# Altium project pcb_82.PrjPcb
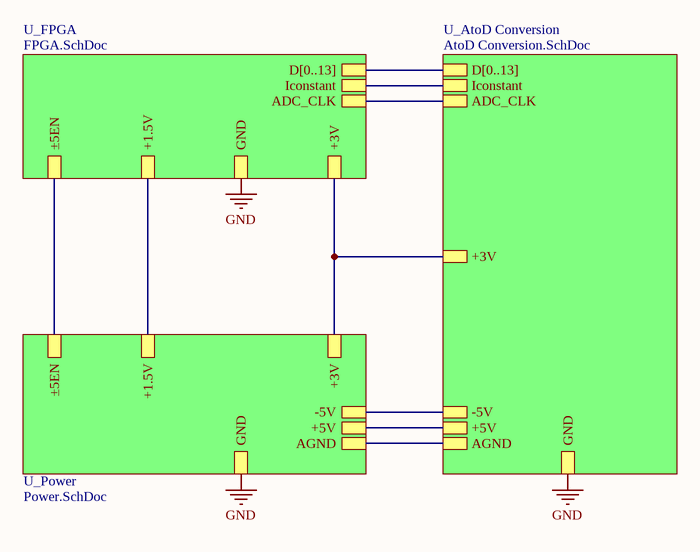
[diagram p0: TOP.SchDoc]
4 sheets, 164 parts. Net scope: hierarchical (ports join the sheet entries above them; power ports are global).
Board file: pcb_82.PcbDoc
Sheets:
  TOP.SchDoc
    U_AtoD Conversion = AtoD Conversion.SchDoc
    U_FPGA = FPGA.SchDoc
    U_Power = Power.SchDoc

## Sheet TOP.SchDoc
size A4; SheetNumber: 1; SheetTotal: 4

### Sub-sheets
U_AtoD Conversion = AtoD Conversion.SchDoc: -5V, +5V, +3V, ADC_CLK, GND, AGND, D[0..13], Iconstant
U_FPGA = FPGA.SchDoc: GND, ±5EN, +1.5V, +3V, Iconstant, D[0..13], ADC_CLK
U_Power = Power.SchDoc: GND, ±5EN, +5V, -5V, +1.5V, +3V, AGND

### Nets
+1.5V: sheet U_FPGA/+1.5V, sheet U_Power/+1.5V
+3V: sheet U_AtoD Conversion/+3V, sheet U_FPGA/+3V, sheet U_Power/+3V
+5V: sheet U_AtoD Conversion/+5V, sheet U_Power/+5V
-5V: sheet U_AtoD Conversion/-5V, sheet U_Power/-5V
AGND: sheet U_AtoD Conversion/AGND, sheet U_Power/AGND
GND: sheet U_AtoD Conversion/GND, sheet U_FPGA/GND, sheet U_Power/GND
NetB4_1: sheet U_AtoD Conversion/ADC_CLK, sheet U_FPGA/ADC_CLK
NetQ4_1: sheet U_AtoD Conversion/Iconstant, sheet U_FPGA/Iconstant
NetU4_4: sheet U_FPGA/±5EN, sheet U_Power/±5EN

### Buses and harness runs
bus sheet U_AtoD Conversion/D[0..13] = sheet U_FPGA/D[0..13]

### Notes on the sheet
- Page
- of

## Sheet AtoD Conversion.SchDoc
size A4; SheetNumber: 4; SheetTotal: 4
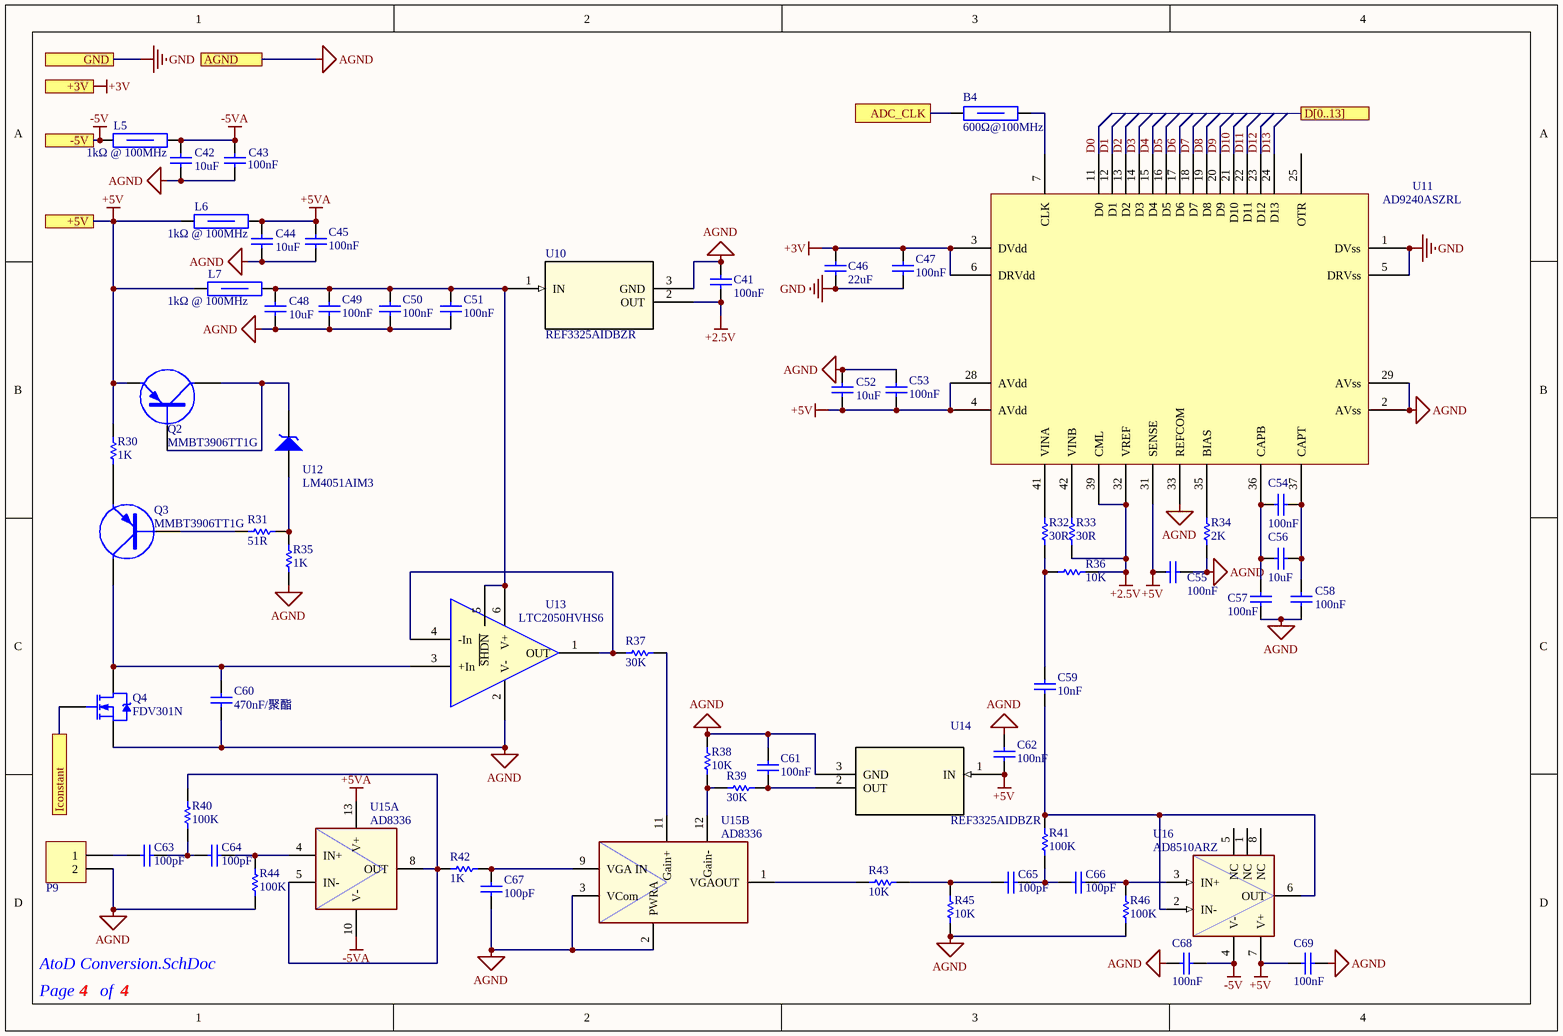
[diagram p1: AtoD Conversion.SchDoc]

### Parts
B4  600Ω@100MHz  [R0805_L]
C41  100nF  [R0603_C]
C42  10uF  [R0805_C]
C43  100nF  [R0603_C]
C44  10uF  [R0805_C]
C45  100nF  [R0603_C]
C46  22uF  [R0805_C]
C47  100nF  [R0603_C]
C48  10uF  [R0805_C]
C49  100nF  [R0603_C]
C50  100nF  [R0603_C]
C51  100nF  [R0603_C]
C52  10uF  [R0805_C]
C53  100nF  [R0603_C]
C54  100nF  [R0603_C]
C55  100nF  [R0603_C]
C56  10uF  [R0805_C]
C57  100nF  [R0603_C]
C58  100nF  [R0603_C]
C59  10nF  [R0603_C]
C60  470nF/聚酯  [P=10MM -L]
C61  100nF  [R0603_C]
C62  100nF  [R0603_C]
C63  100pF  [R0603_C]
C64  100pF  [R0603_C]
C65  100pF  [R0603_C]
C66  100pF  [R0603_C]
C67  100pF  [R0603_C]
C68  100nF  [R0603_C]
C69  100nF  [R0603_C]
L5  1kΩ @ 100MHz  [R1206_L]
L6  1kΩ @ 100MHz  [R1206_L]
L7  1kΩ @ 100MHz  [R1206_L]
P9  Header 2  [CP1X2]  (value not drawn)
Q2  MMBT3906TT1G  [SOT-23(SOT-23-3)]
Q3  MMBT3906TT1G  [SOT-23(SOT-23-3)]
Q4  FDV301N  [SOT-23]
R30  1K  [R0603_R]
R31  51R  [R0603_R]
R32  30R  [R0603_R]
R33  30R  [R0603_R]
R34  2K  [R0603_R]
R35  1K  [R0603_R]
R36  10K  [R0603_R]
R37  30K  [R0603_R]
R38  10K  [R0603_R]
R39  30K  [R0603_R]
R40  100K  [R0603_R]
R41  100K  [R0603_R]
R42  1K  [R0603_R]
R43  10K  [R0603_R]
R44  100K  [R0603_R]
R45  10K  [R0603_R]
R46  100K  [R0603_R]
U10  REF3325AIDBZR  [SOT-23(SOT-23-3)]
U11  AD9240ASZRL  [MQFP44]
U12  LM4051AIM3  [SOT-23(SOT-23-3)]
U13  LTC2050HVHS6  [DBV0006A_N]
U14  REF3325AIDBZR  [SOT-23(SOT-23-3)]
U15  AD8336  [LFCSP16]  (parts A,B of 2)
U16  AD8510ARZ  [SOP-8_150mil]

### Ports
+3V, +5V, -5V, ADC_CLK, AGND, D[0..13], GND, Iconstant

### Nets
+2.5V: C41.2 R33.1 R36.1 U10.2(OUT) U11.32(VREF) U11.39(CML)
+3V: C46.2 C47.2 U11.3(DVdd) U11.6(DRVdd) ; port +3V
+5V: C52.1 C53.1 C55.2 C62.1 C69.2 L6.1 L7.1 Q2.2(E) R30.2 U11.4(AVdd) U11.28(AVdd) U11.31(SENSE) U14.1(IN) U16.7(V+) ; port +5V
+5VA: C44.2 C45.2 L6.2 U15.13(V+)
-5V: C68.1 L5.1 U16.4(V-) ; port -5V
-5VA: C42.2 C43.2 L5.2 U15.10(V-)
AGND: C41.1 C42.1 C43.1 C44.1 C45.1 C48.1 C49.1 C50.1 C51.1 C52.2 C53.2 C55.1 C57.2 C58.2 C60.1 C61.2 C62.2 C67.1 C68.2 C69.1 P9.2 Q4.2(S) R34.1 R35.1 R38.2 R44.2 R45.1 R46.2 U10.3(GND) U11.2(AVss) U11.29(AVss) U11.33(REFCOM) U13.2(V-) U14.3(GND) U15.2(PWRA) U15.3(VCom) ; port AGND
GND: C46.1 C47.1 U11.1(DVss) U11.5(DRVss) ; port GND
D0: U11.11(D0)
D1: U11.12(D1)
D2: U11.13(D2)
D3: U11.14(D3)
D4: U11.15(D4)
D5: U11.16(D5)
D6: U11.17(D6)
D7: U11.18(D7)
D8: U11.19(D8)
D9: U11.20(D9)
D10: U11.21(D10)
D11: U11.22(D11)
D12: U11.23(D12)
D13: U11.24(D13)
NetB4_1: B4.1 ; port ADC_CLK
NetB4_2: B4.2 U11.7(CLK)
NetC48_2: C48.2 C49.2 C50.2 C51.2 L7.2 U10.1(IN) U13.5(~{SHDN}) U13.6(V+)
NetC54_1: C54.1 C56.1 C58.1 U11.37(CAPT)
NetC54_2: C54.2 C56.2 C57.1 U11.36(CAPB)
NetC59_1: C59.1 R41.1 U16.2(IN-) U16.6(OUT)
NetC59_2: C59.2 R32.1 R36.2
NetC60_2: C60.2 Q3.3(C) Q4.3(D) U13.3(+In)
NetC61_1: C61.1 R39.1 U14.2(OUT)
NetC63_1: C63.1 P9.1
NetC63_2: C63.2 C64.1 R40.2
NetC64_2: C64.2 R44.1 U15.4(IN+)
NetC65_1: C65.1 R43.1 R45.2
NetC65_2: C65.2 C66.1 R41.2
NetC66_2: C66.2 R46.1 U16.3(IN+)
NetC67_2: C67.2 R42.1 U15.9(VGA_IN)
NetQ2_1: Q2.1(B) Q2.3(C) U12.1
NetQ3_1: Q3.1(B) R31.1
NetQ3_2: Q3.2(E) R30.1
NetQ4_1: Q4.1(G) ; port Iconstant
NetR31_2: R31.2 R35.2 U12.2
NetR32_2: R32.2 U11.41(VINA)
NetR33_2: R33.2 U11.42(VINB)
NetR34_2: R34.2 U11.35(BIAS)
NetR37_1: R37.1 U13.1(OUT) U13.4(-In)
NetR37_2: R37.2 U15.11(Gain+)
NetR38_1: R38.1 R39.2 U15.12(Gain-)
NetR40_1: R40.1 R42.2 U15.5(IN-) U15.8(OUT)
NetR43_2: R43.2 U15.1(VGAOUT)

Not connected (* = marked no-connect by the designer): U11 25(OTR); U16 1(NC) 5(NC) 8(NC)

### Notes on the sheet
- Page
- of

### Library data of the parts
B4 = 600Ω@100MHz: 600Ω @ 100MHz / 线路数 1 / 额定电流（最大） 600mA / 直流电阻（DCR）（最大） 210mΩ; 厂家: muRata(村田); 型号: BLM21AG601SN1D; 封装: 0805; 类型: Bead; 订货编码: C85837
C41 C43 C45 C47 C49-C51 C53-C55 C57 C58 C61 C62 C68 C69 = 100nF/0603/50V: 精度 ±10% / 容值 100nF / 额定电压 50V / 温漂系数（介质材料) X7R; 厂家: FH(风华); 型号: 0603B104K500NT; 封装: 0603; 类型: Capacitor; 订货编码: C30926
C42 C44 C48 C52 C56 = 10uF/0805/16V: 精度 ±10% / 容值 10uF / 额定电压 16V / 温漂系数（介质材料) X7R; 厂家: FH(风华); 型号: 0805B106K160NT; 封装: 0805; 类型: Capacitor; 订货编码: C92341
C46 = 22uF/0805/25V: 精度 ±20% / 容值 22uF / 额定电压 25V / 温漂系数（介质材料) X5R; 厂家: muRata(村田); 型号: GRM21BR61E226ME44L; 封装: 0805; 类型: Capacitor; 订货编码: C86816
C59 = 10nF/0603/C0G/50V: 精度 ±5% / 容值 10nF / 额定电压 50V / 温漂系数（介质材料) C0G; 厂家: FH(风华); 型号: 0603CG103J500NT; 封装: 0603; 类型: Capacitor; 订货编码: C82282
C60 = 470nF/10mm/450V: 聚酯薄膜电容 / 脚间距（mm） 10 / 精度 ±5% / 容值 470nF / 额定直流耐压DC 450V / 工作温度 -55℃ ~ +105℃; 厂家: faratronic(厦门法拉); 型号: C222S474J40Y350; 封装: P=10mm; 类型: Capacitor; 订货编码: C280341
C63-C67 = 100pF/0603/50V: 精度 ±5% / 容值 100pF / 额定电压 50V / 温漂系数（介质材料) C0G; 厂家: FH(风华); 型号: 0603CG101J500NT; 封装: 0603; 类型: Capacitor; 订货编码: C1635
L5-L7 = 1kΩ@100MHz: 阻抗 @ 频率 1kΩ @ 100MHz / 线路数 1 / 额定电流（最大） 2A / 直流电阻（DCR）（最大） 120mΩ; 厂家: FH(风华); 型号: CBM321609U102T; 封装: 1206; 类型: Bead; 订货编码: C139169
P9 = Header 2: Header, 2-Pin; 厂家: /; System: Connector; 型号: /; 封装: /; 类型: /; 订货编码: /
Q2 Q3 = MMBT3906TT1G: 额定功率 200mW / 集电极电流Ic 200mA / 集射极击穿电压Vce 40V / 晶体管类型 PNP; 厂家: ON(安森美); 封装: SOT23-3; 订货编码: C82042; 型号: MMBT3906TT1G; 类型: PNP
Q4 = FDV301N: 漏源电压（Vdss） 25V / 连续漏极电流（Id）（25°C 时） 220mA / 栅源极阈值电压 1.06V @ 250uA / 漏源导通电阻 4Ω @ 400mA,4.5V / 最大功率耗散（Ta=25°C） 350mW / 类型 N沟道; 厂家: ON(安森美); 封装: SOT-23-3; 类型: MOS(场效应管); 订货编码: C15310; 型号: FDV301N
R30 R35 R42 = 1K/0603: 精度 ±1% / 温度系数 ±100ppm/℃ / 阻值 1kΩ / 功率 0.1W; 厂家: FH(风华); 型号: RS-03K1001FT; 类型: Resistor; 订货编码: C115325; 封装: 0603
R31 = 51R/0603: 精度 ±1% / 温度系数 ±100ppm/℃ / 功率 0.1W / 阻值 51Ω; 厂家: FH(风华); 型号: RS-03K51R0FT; 类型: Resistor; 订货编码: C146828; 封装: 0603
R32 R33 = 30R/0603: 精度 ±1% / 阻值 30Ω / 温度系数 ±100ppm/℃ / 功率 0.1W; 厂家: FH(风华); 型号: RS-03K30R0FT; 类型: Resistor; 订货编码: C321848; 封装: 0603
R34 = 2K/0603: 精度 ±1% / 阻值 2kΩ / 温度系数 ±100ppm/℃ / 功率 0.1W; 厂家: FH(风华); 型号: RS-03K2001FT; 类型: Resistor; 订货编码: C115336; 封装: 0603
R36 R38 R43 R45 = 10K/0603: 精度 ±1% / 温度系数 ±100ppm/℃ / 阻值 10kΩ / 功率 0.1W; 厂家: FH(风华); 型号: RS-03K1002FT; 类型: Resistor; 订货编码: C115324; 封装: 0603
R37 R39 = 30K/0603: 精度 ±1% / 阻值 30kΩ / 温度系数 ±100ppm/℃ / 功率 0.1W; 厂家: FH(风华); 型号: RS-03K3002FT; 类型: Resistor; 订货编码: C140100; 封装: 0603
R40 R41 R44 R46 = 100K/0603: 精度 ±1% / 阻值 100kΩ / 温度系数 ±100ppm/℃ / 功率 0.1W; 厂家: FH(风华); 型号: RS-03K1003FT; 类型: Resistor; 订货编码: C115320; 封装: 0603
U10 U14 = REF3325AIDBZR: 输出电压（最小值/固定） 2.5V / 输出电流 5mA / 输出电压（最大值） - / 输入电压 2.7 V ~ 5.5 V / 电源电流 8.5uA / 输出类型 固定 / 工作温度 -40°C ~ 125°C(TA) / 温度系数 30ppm/°C / 阴极电流 - / 精度 ±0.15% / 参考源类型 系列; 厂家: TI(德州仪器); 封装: SOT23-3; 类型: 电源参考; 订货编码: C69039; 型号: REF3325AIDBZR
U11 = AD9240ASZRL: 模数转换芯片 / 读写接口类型 Parallel / 工作电压 5V / 输入类型 Differential, Single Ended / 参考类型 External, Internal / 输入数 1 / 采样率（sps） 10M / A/D 位数 14; 厂家: ADI(亚德诺); 封装: MQFP-44; 订货编码: C38677; 型号: AD9240ASZRL; 类型: 模数转换芯片
U12 = LM4051AIM3-ADJ/NOPB: 1.212V / 输出电流 12mA / 输出电压（最大值） 10V / 输入电压 - / 电源电流 - / 输出类型 可调式 / 工作温度 -40°C ~ 85°C(TA) / 温度系数 50ppm/°C / 阴极电流 65uA / 精度 ±0.1% / 参考源类型 分流器; 厂家: TI(德州仪器); 封装: SOT-23; 类型: 并联电压参考; 订货编码: C181558; 型号: LM4051AIM3-ADJ/NOPB
U13 = LTC2050HVHS6: 厂家: ADI(亚德诺); 型号: LTC2050HVHS6#TRPBF; 封装: TSOT-23-6; 类型: 运放; 订货编码: C679145
U15 = AD8336ACPZ WP: 厂家: ADI(亚德诺); 封装: LFCSP-16; 类型: 特殊功能放大器; 订货编码: C1523374; 型号: AD8336ACPZ WP
U16 = AD8510ARZ: FET输入运放 / 增益带宽积（GBP） 8MHz / 放大器组数 1 / 输出类型 - / 运放类型 J-FET / 各通道功耗 - / 压摆率（SR） 20 V/us / 工作温度 -40°C ~ 125°C / 电源电压 ±4.5V ~ 18V; 厂家: TI(德州仪器); 型号: AD8510ARZ-REEL7; 封装: SOIC-8_150mil; 类型: 运放; 订货编码: C44017

## Sheet FPGA.SchDoc
size A4; SheetNumber: 3; SheetTotal: 4
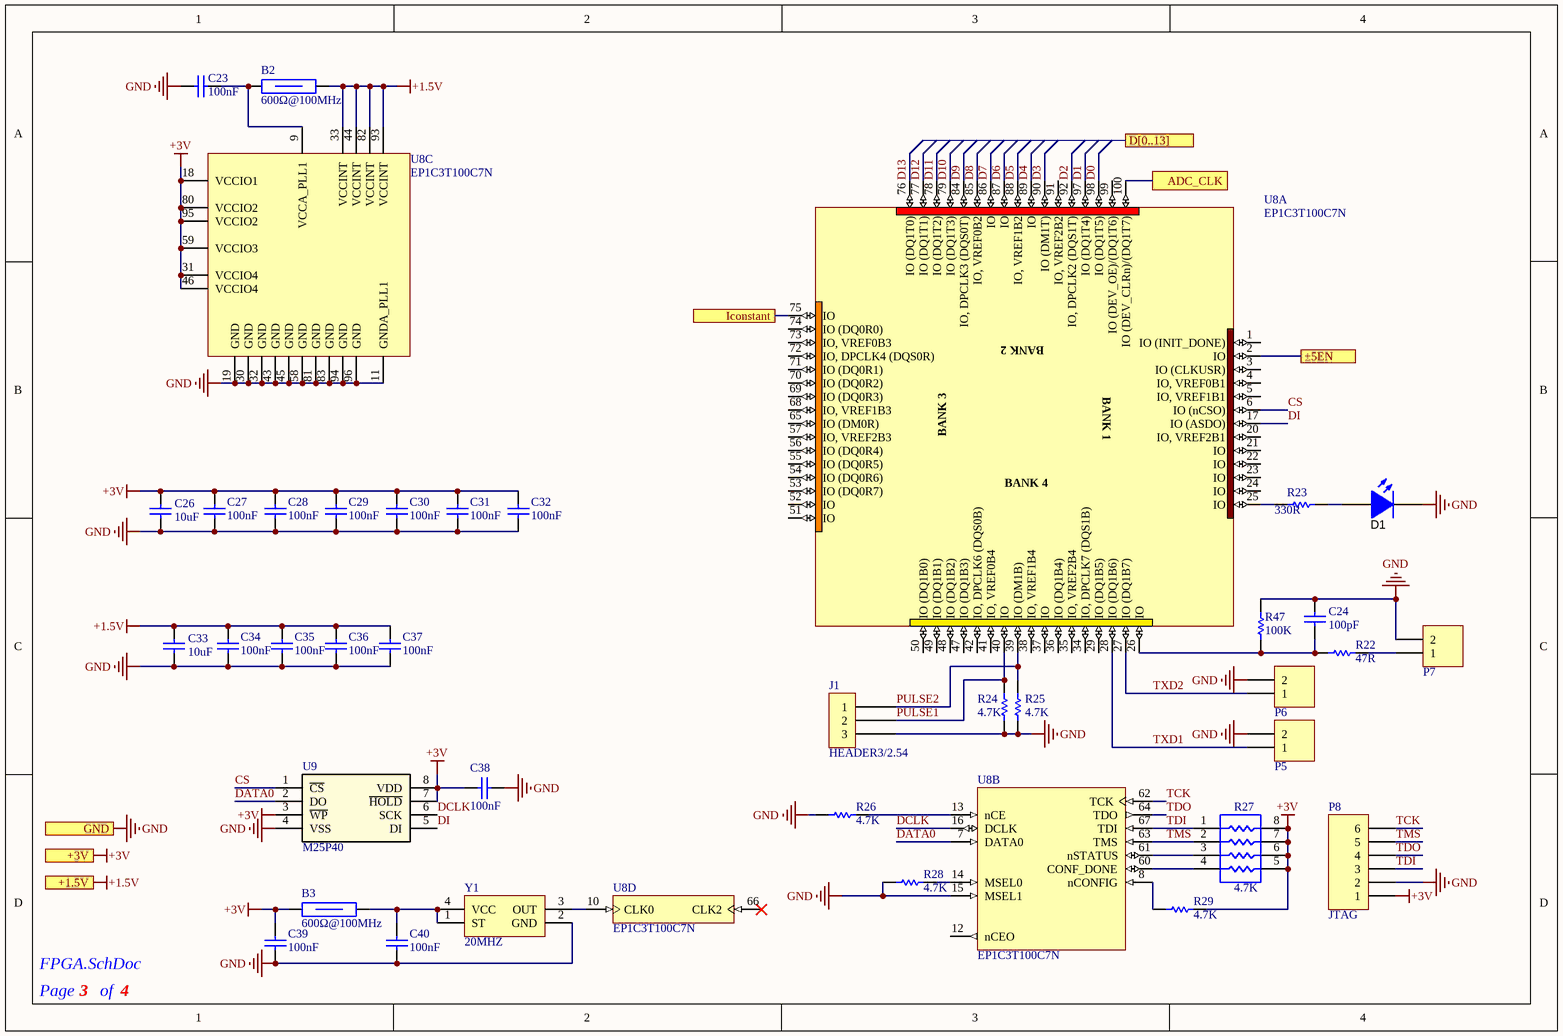
[diagram p2: FPGA.SchDoc]

### Parts
B2  600Ω@100MHz  [R0805_L]
B3  600Ω@100MHz  [R0805_L]
C23  100nF  [R0603_C]
C24  100pF  [R0603_C]
C26  10uF  [R0805_C]
C27  100nF  [R0603_C]
C28  100nF  [R0603_C]
C29  100nF  [R0603_C]
C30  100nF  [R0603_C]
C31  100nF  [R0603_C]
C32  100nF  [R0603_C]
C33  10uF  [R0805_C]
C34  100nF  [R0603_C]
C35  100nF  [R0603_C]
C36  100nF  [R0603_C]
C37  100nF  [R0603_C]
C38  100nF  [R0603_C]
C39  100nF  [R0603_C]
C40  100nF  [R0603_C]
D1  MHT192WDT-C2  [LED_0603_RED]  (value not drawn)
J1  HEADER3/2.54  [SIP3/2.54]
P5  Header 2  [CP1X2]  (value not drawn)
P6  Header 2  [CP1X2]  (value not drawn)
P7  Header 2  [CP1X2]  (value not drawn)
P8  JTAG  [CP1X6]
R22  47R  [R0603_R]
R23  330R  [R0603_R]
R24  4.7K  [R0603_R]
R25  4.7K  [R0603_R]
R26  4.7K  [R0603_R]
R27  4.7K  [R0603X4]
R28  4.7K  [R0603_R]
R29  4.7K  [R0603_R]
R47  100K  [R0603_R]
U8  EP1C3T100C7N  [TQFP100]  (parts A,B,C,D of 4)
U9  M25P40  [SOP-8_150mil]
Y1  20MHZ  [SMD-3225]

### Ports
+1.5V, +3V, ADC_CLK, D[0..13], GND, Iconstant, ±5EN

### Nets
+1.5V: B2.2 C33.1 C34.2 C35.2 C36.2 C37.2 U8.33(VCCINT) U8.44(VCCINT) U8.82(VCCINT) U8.93(VCCINT) ; port +1.5V
+3V: B3.1 C26.2 C27.2 C28.2 C29.2 C30.2 C31.2 C32.2 C38.2 C39.2 P8.1 R27.5 R27.6 R27.7 R27.8 R29.1 U8.18(VCCIO1) U8.31(VCCIO4) U8.46(VCCIO4) U8.59(VCCIO3) U8.80(VCCIO2) U8.95(VCCIO2) U9.3(~{WP}) U9.7(~{HOLD}) U9.8(VDD) ; port +3V
GND: C23.2 C24.1 C26.1 C27.1 C28.1 C29.1 C30.1 C31.1 C32.1 C33.2 C34.1 C35.1 C36.1 C37.1 C38.1 C39.1 C40.1 D1.2(K) J1.3 P5.2 P6.2 P7.2 P8.2 R24.2 R25.2 R26.2 R28.1 R47.1 U8.11(GNDA_PLL1) U8.15(MSEL1) U8.19(GND) U8.30(GND) U8.32(GND) U8.43(GND) U8.45(GND) U8.58(GND) U8.81(GND) U8.83(GND) U8.94(GND) U8.96(GND) U9.4(VSS) Y1.2(GND) ; port GND
CS: U8.6(IO_(nCSO)) U9.1(~{CS})
D0: U8.98(IO_(DQ1T5))
D1: U8.97(IO_(DQ1T4))
D2: U8.92(IO,_DPCLK2_(DQS1T))
D3: U8.90(IO_(DM1T))
D4: U8.89(IO)
D5: U8.88(IO,_VREF1B2)
D6: U8.87(IO)
D7: U8.86(IO)
D8: U8.85(IO,_VREF0B2)
D9: U8.84(IO,_DPCLK3_(DQS0T))
D10: U8.79(IO_(DQ1T3))
D11: U8.78(IO_(DQ1T2))
D12: U8.77(IO_(DQ1T1))
D13: U8.76(IO_(DQ1T0))
DATA0: U8.7(DATA0) U9.2(DO)
DCLK: U8.16(DCLK) U9.6(SCK)
DI: U8.17(IO_(ASDO)) U9.5(DI)
PULSE1: J1.2 R24.1 U8.40(IO)
PULSE2: J1.1 R25.1 U8.39(IO_(DM1B))
TCK: P8.6 U8.62(TCK)
TDI: P8.3 R27.1 U8.67(TDI)
TDO: P8.4 U8.64(TDO)
TMS: P8.5 R27.2 U8.63(TMS)
TXD1: P5.1 U8.28(IO_(DQ1B6))
TXD2: P6.1 U8.27(IO_(DQ1B7))
NetB2_1: B2.1 C23.1 U8.9(VCCA_PLL1)
NetB3_2: B3.2 C40.2 Y1.1(ST) Y1.4(VCC)
NetB4_1: U8.100(IO_(DEV_CLRn)/(DQ1T7)) ; port ADC_CLK
NetC24_2: C24.2 R22.1 R47.2 U8.26(IO)
NetD1_1: D1.1(A) R23.2
NetP7_1: P7.1 R22.2
NetQ4_1: U8.75(IO) ; port Iconstant
NetR23_1: R23.1 U8.25(IO)
NetR26_1: R26.1 U8.13(nCE)
NetR27_3: R27.3 U8.61(nSTATUS)
NetR27_4: R27.4 U8.60(CONF_DONE)
NetR28_2: R28.2 U8.14(MSEL0)
NetR29_2: R29.2 U8.8(nCONFIG)
NetU4_4: U8.2(IO) ; port ±5EN
NetU8_10: U8.10(CLK0) Y1.3(OUT)

Not connected (* = marked no-connect by the designer): U8 1(IO_(INIT_DONE)) 3(IO_(CLKUSR)) 4(IO,_VREF0B1) 5(IO,_VREF1B1) 12(nCEO) 20(IO,_VREF2B1) 21(IO) 22(IO) 23(IO) 24(IO) 29(IO_(DQ1B5)) 34(IO,_DPCLK7_(DQS1B)) 35(IO,_VREF2B4) 36(IO_(DQ1B4)) 37(IO) 38(IO,_VREF1B4) 41(IO,_VREF0B4) 42(IO,_DPCLK6_(DQS0B)) 47(IO_(DQ1B3)) 48(IO_(DQ1B2)) 49(IO_(DQ1B1)) 50(IO_(DQ1B0)) 51(IO) 52(IO) 53(IO_(DQ0R7)) 54(IO_(DQ0R6)) 55(IO_(DQ0R5)) 56(IO_(DQ0R4)) 57(IO,_VREF2B3) 65(IO_(DM0R)) 66(CLK2)* 68(IO,_VREF1B3) 69(IO_(DQ0R3)) 70(IO_(DQ0R2)) 71(IO_(DQ0R1)) 72(IO,_DPCLK4_(DQS0R)) 73(IO,_VREF0B3) 74(IO_(DQ0R0)) 91(IO,_VREF2B2) 99(IO_(DEV_OE)/(DQ1T6))

### Notes on the sheet
- Page
- of
- (in symbol EP1C3T100C7N, part A) BANK 2; BANK 1; BANK 3; BANK 4

### Library data of the parts
B2 B3 = 600Ω@100MHz: as B4 on sheet AtoD Conversion
C23 C27-C32 C34-C40 = 100nF/0603/50V: as C41 on sheet AtoD Conversion
C24 = 100pF/0603/50V: as C63 on sheet AtoD Conversion
C26 C33 = 10uF/0805/16V: as C42 on sheet AtoD Conversion
D1 = MHT192WDT-C2: LED SMD贴片0603顶部发光 / 黄色雾状胶体，高亮白色光 / 电压VF:2.6-3.1V@5mA / 亮度Iv:228-450mcd@5mA / 坐标x:0.3,y:0.3 / 发光角度:120deg; 厂家: MEIHUA(美华科技); 封装: 0603; 订货编码: C389521; 型号: MHT192WDT-C2; 类型: LED
J1 = HEADER3/2.54: 3pin,单排,2.54mm间距; 厂家: /; System: Connector; 型号: /; 封装: /; 类型: /; 订货编码: /
P5-P7 = Header 2: Header, 2-Pin; 厂家: /; System: Connector; 型号: /; 封装: /; 类型: /; 订货编码: /
P8 = Header 6: Header, 6-Pin; 厂家: /; System: Connector; 型号: /; 封装: /; 类型: /; 订货编码: /
R22 = 47R/0603: 精度 ±1% / 温度系数 ±100ppm/℃ / 阻值 47Ω / 功率 0.1W; 厂家: FH(风华); 型号: RS-03K47R0FT; 类型: Resistor; 订货编码: C140087; 封装: 0603
R23 = 330R/0603: 精度 ±1% / 温度系数 ±100ppm/℃ / 阻值 330Ω / 功率 0.1W; 厂家: FH(风华); 型号: RS-03K3300FT; 类型: Resistor; 订货编码: C125768; 封装: 0603
R24-R26 R28 R29 = 4.7K/0603: 精度 ±1% / 阻值 4.7kΩ / 温度系数 ±100ppm/℃ / 功率 0.1W; 厂家: FH(风华); 型号: RS-03K4701FT; 类型: Resistor; 订货编码: C116693; 封装: 0603
R27 = 4.7K/0603X4: 4.7K / 电阻器数 4 / 精度 ±1% / 安装类型 表面贴装 / 每元件功率 1/16W / 温度系数 ±200ppm/℃; 厂家: UNI-ROYAL(厚声); 型号: 4D03WGF4701T5E; 类型: Resistor; 订货编码: C66697; 封装: 0603_x4
R47 = 100K/0603: as R40 on sheet AtoD Conversion
U8 = EP1C3T100C7N: Cyclone Family, 1.5V FPGA, 65 I/O Pins, 1 x PLL, Commercial Grade, Speed Grade 7, Pb-Free; 厂家: INTEL; 型号: EP1C3T100C7NA; 封装: TQFP100; 类型: FPGA; 订货编码: -
U9 = M25P40: FLASH - NOR / 4Mb（512K x 8） / SPI / 电压 - 供电 / 2.3V ~ 3.6V / 工作温度 / -40°C ~ 85°C（TA）; 厂家: micron(镁光); 型号: M25P40-VMN6TPB; 封装: SOIC-8; 类型: FLASH存储器; 订货编码: C524852
Y1 = SG-310SCF 20MHZ L: 工作电压 2.7V ~ 3.6V / 主频 20MHz / 频率稳定度 ±50ppm / 工作温度 -40℃~85℃; 厂家: EPSON(爱普生); 型号: Q33310F70051500; 封装: SMD-3225_4P; 类型: 有源晶振; 订货编码: C32529

## Sheet Power.SchDoc
size A4; SheetNumber: 2; SheetTotal: 4
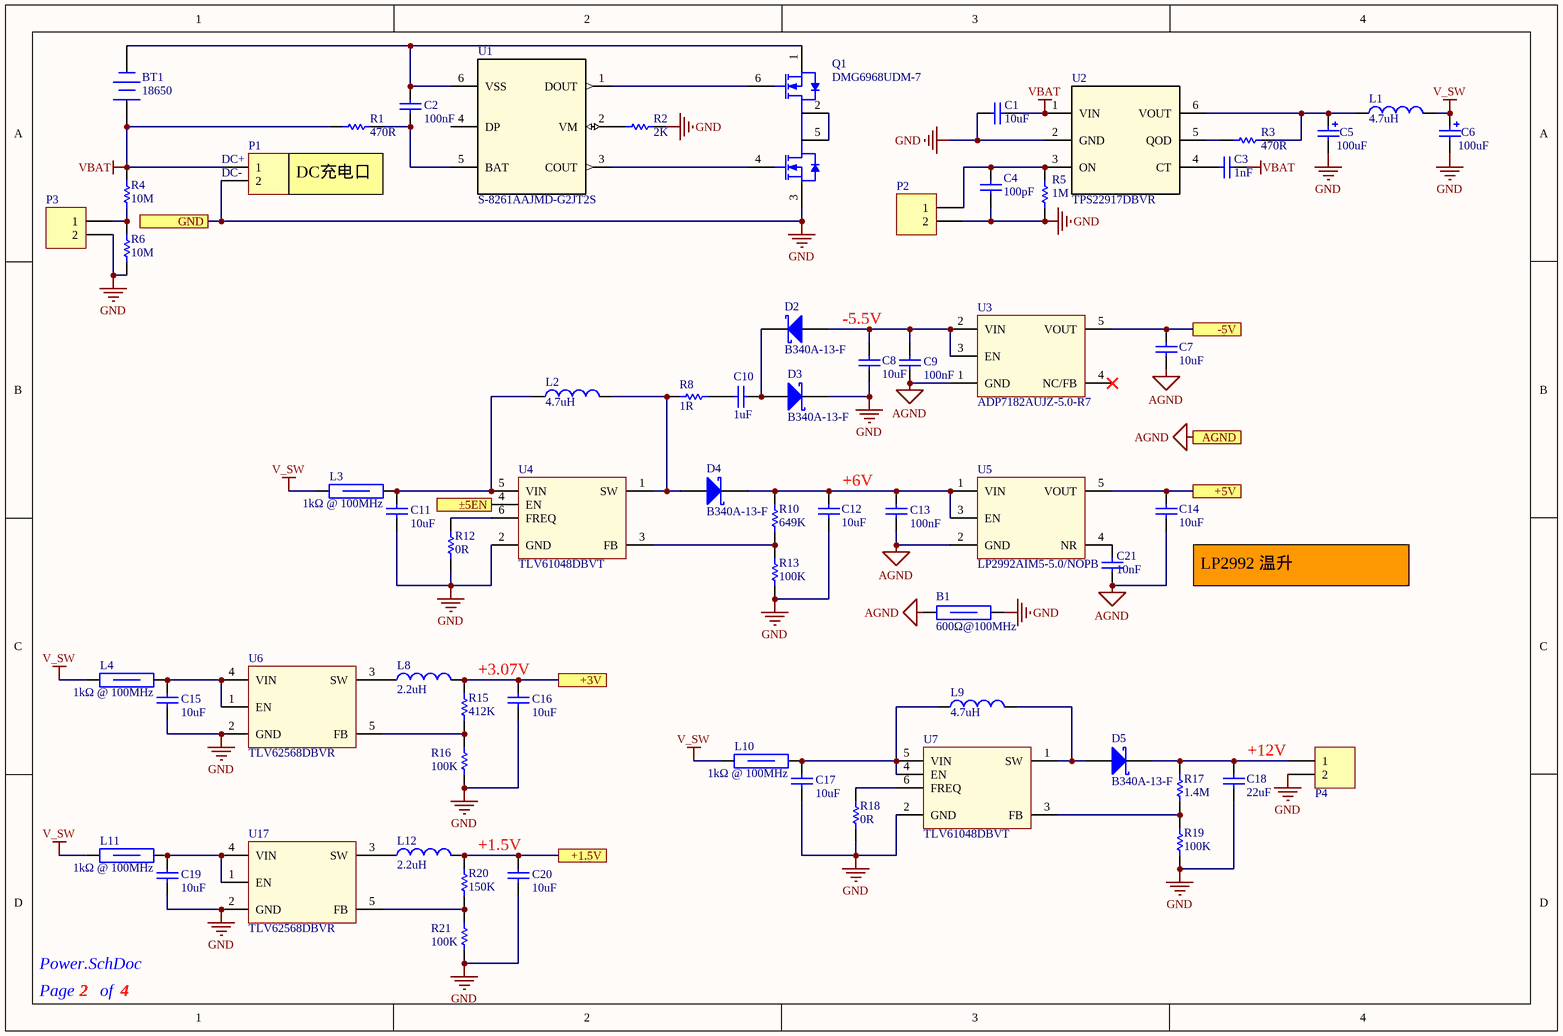
[diagram p3: Power.SchDoc]

### Parts
B1  600Ω@100MHz  [R0805_L]
BT1  18650  [CP1X2]
C1  10uF  [R0805_C]
C2  100nF  [R0603_C]
C3  1nF  [R0603_C]
C4  100pF  [R0603_C]
C5  100uF  [CASE-E_7343]
C6  100uF  [CASE-E_7343]
C7  10uF  [R0805_C]
C8  10uF  [R0805_C]
C9  100nF  [R0603_C]
C10  1uF  [R0603_C]
C11  10uF  [R0805_C]
C12  10uF  [R0805_C]
C13  100nF  [R0603_C]
C14  10uF  [R0805_C]
C15  10uF  [R0805_C]
C16  10uF  [R0805_C]
C17  10uF  [R0805_C]
C18  22uF  [R1210_C]
C19  10uF  [R0805_C]
C20  10uF  [R0805_C]
C21  10nF  [R0603_C]
D2  B340A-13-F  [SMA(DO-214AC)_S2]
D3  B340A-13-F  [SMA(DO-214AC)_S2]
D4  B340A-13-F  [SMA(DO-214AC)_S2]
D5  B340A-13-F  [SMA(DO-214AC)_S2]
L1  4.7uH  [NR2520]
L2  4.7uH  [NR2520]
L3  1kΩ @ 100MHz  [R1206_L]
L4  1kΩ @ 100MHz  [R1206_L]
L8  2.2uH  [NR2016]
L9  4.7uH  [NR2520]
L10  1kΩ @ 100MHz  [R1206_L]
L11  1kΩ @ 100MHz  [R1206_L]
L12  2.2uH  [NR2016]
P1  Header 2  [CP1X2]  (value not drawn)
P2  Header 2  [CP1X2]  (value not drawn)
P3  Header 2  [CP1X2]  (value not drawn)
P4  Header 2  [CP1X2]  (value not drawn)
Q1  DMG6968UDM-7  [DBV0006A_N]
R1  470R  [R0603_R]
R2  2K  [R0603_R]
R3  470R  [R0603_R]
R4  10M  [R0603_R]
R5  1M  [R0603_R]
R6  10M  [R0603_R]
R8  1R  [R0603_R]
R10  649K  [R0603_R]
R12  0R  [R0603_R]
R13  100K  [R0603_R]
R15  412K  [R0603_R]
R16  100K  [R0603_R]
R17  1.4M  [R0603_R]
R18  0R  [R0603_R]
R19  100K  [R0603_R]
R20  150K  [R0603_R]
R21  100K  [R0603_R]
U1  S-8261AAJMD-G2JT2S  [DBV0006A_N]
U2  TPS22917DBVR  [DBV0006A_N]
U3  ADP7182AUJZ-5.0-R7  [SOT23-5]
U4  TLV61048DBVT  [DBV0006A_N]
U5  LP2992AIM5-5.0/NOPB  [SOT23-5]
U6  TLV62568DBVR  [SOT23-5]
U7  TLV61048DBVT  [DBV0006A_N]
U17  TLV62568DBVR  [SOT23-5]

### Ports
+1.5V, +3V, +5V, -5V, AGND, GND, ±5EN

### Nets
+1.5V: C20.2 L12.2 R20.2 ; port +1.5V
+3V: C16.2 L8.2 R15.2 ; port +3V
+5V: C14.1 U5.5(VOUT) ; port +5V
-5V: C7.1 U3.5(VOUT) ; port -5V
AGND: B1.1 C7.2 C9.2 C13.2 C14.2 C21.1 U3.1(GND) U5.2(GND) ; port AGND
GND: B1.2 C1.1 C4.1 C5.2 C6.2 C8.2 C11.1 C12.1 C15.1 C16.1 C17.1 C18.1 C19.1 C20.1 D3.2(K) P1.2 P2.2 P3.2 P4.2 Q1.3(S2) R2.2 R5.1 R6.2 R12.1 R13.1 R16.1 R18.1 R19.1 R21.1 U2.2(GND) U4.2(GND) U6.2(GND) U7.2(GND) U17.2(GND) ; port GND
V_SW: C6.1 L1.2 L3.1 L4.1 L10.1 L11.1
VBAT: BT1.1(+) C1.2 C3.2 P1.1 R1.1 R4.1 U2.1(VIN)
NetBT1_2: BT1.2(-) C2.1 Q1.1(S1) U1.6(VSS)
NetC2_2: C2.2 R1.2 U1.5(BAT)
NetC3_1: C3.1 U2.4(CT)
NetC4_2: C4.2 P2.1 R5.2 U2.3(ON)
NetC5_1: C5.1 L1.1 R3.2 U2.6(VOUT)
NetC8_1: C8.1 C9.1 D2.1(A) U3.2(VIN) U3.3(EN)
NetC10_1: C10.1 D2.2(K) D3.1(A)
NetC10_2: C10.2 R8.2
NetC11_2: C11.2 L2.1 L3.2 U4.5(VIN)
NetC12_2: C12.2 C13.1 D4.2(K) R10.2 U5.1(VIN) U5.3(EN)
NetC15_2: C15.2 L4.2 U6.1(EN) U6.4(VIN)
NetC17_2: C17.2 L9.1 L10.2 U7.4(EN) U7.5(VIN)
NetC18_2: C18.2 D5.2(K) P4.1 R17.2
NetC19_2: C19.2 L11.2 U17.1(EN) U17.4(VIN)
NetC21_2: C21.2 U5.4(NR)
NetD4_1: D4.1(A) L2.2 R8.1 U4.1(SW)
NetD5_1: D5.1(A) L9.2 U7.1(SW)
NetL8_1: L8.1 U6.3(SW)
NetL12_1: L12.1 U17.3(SW)
NetP3_1: P3.1 R4.2 R6.1
NetQ1_2: Q1.2(D1/D2) Q1.5(D1/D2)
NetQ1_4: Q1.4(G2) U1.3(COUT)
NetQ1_6: Q1.6(G1) U1.1(DOUT)
NetR2_1: R2.1 U1.2(VM)
NetR3_1: R3.1 U2.5(QOD)
NetR10_1: R10.1 R13.2 U4.3(FB)
NetR12_2: R12.2 U4.6(FREQ)
NetR15_1: R15.1 R16.2 U6.5(FB)
NetR17_1: R17.1 R19.2 U7.3(FB)
NetR18_2: R18.2 U7.6(FREQ)
NetR20_1: R20.1 R21.2 U17.5(FB)
NetU4_4: U4.4(EN) ; port ±5EN

Not connected (* = marked no-connect by the designer): U1 4(DP); U3 4(NC/FB)*

### Notes on the sheet
- (near P1) DC+
- (near P1) DC-
- DC充电口
- -5.5V
- +6V
- (near C14) LP2992 温升17℃@100ma
- +3.07V
- (near C18) +12V
- +1.5V
- Page
- of

### Library data of the parts
B1 = 600Ω@100MHz: as B4 on sheet AtoD Conversion
BT1 = Battery_18650_DIP: 18650单节直插电池仓; 型号: DIP-18650; 封装: DIP; 类型: 电池盒/电池座; System: Connector; 厂家: -; 订货编码: -
C1 C7 C8 C11 C12 C14-C17 C19 C20 = 10uF/0805/16V: as C42 on sheet AtoD Conversion
C2 C9 C13 = 100nF/0603/50V: as C41 on sheet AtoD Conversion
C3 = 1nF/0603/50V: 精度 ±5% / 容值 1nF / 额定电压 50V / 温漂系数（介质材料) C0G; 厂家: FH(风华); 型号: 0603CG102J500NT; 封装: 0603; 类型: Capacitor; 订货编码: C1636
C4 = 100pF/0603/50V: as C63 on sheet AtoD Conversion
C5 C6 = Cap Pol/100uF/16V: 钽电容 / 精度 ±10% / 容值 100uF / 额定电压 16V / ESR串联电阻 900 mΩ @ 100kHz / 工作温度 -55℃~125℃; 厂家: AVX; 型号: TAJE107K016RNJ; 订货编码: C106186; 封装: CASE-E_7343; 类型: 钽电容
C10 = 1uF/0603/50V: 精度 ±10% / 容值 1uF / 额定电压 50V / 温漂系数（介质材料) X7R; 厂家: FH(风华); 型号: 0603B105K500NT; 封装: 0603; 类型: Capacitor; 订货编码: C90540
C18 = 22uF/1210/25V: ±10% / 容值 22uF / 额定电压 25V / 温漂系数（介质材料) X7R; 厂家: muRata(村田); 型号: GRM32ER71E226KE15L; 封装: 1210; 类型: Capacitor; 订货编码: C21397
C21 = 10nF/0603/C0G/50V: 精度 ±5% / 容值 10nF / 额定电压 50V / 温漂系数（介质材料) C0G; 厂家: FH(风华); 型号: 0603CG103J500NT; 类型: Capacitor; 订货编码: C82282; 封装: 0603
D2-D5 = B340A-13-F: 直流反向耐压（Vr） 40V / 平均整流电流（Io） 3A / 正向压降（Vf） 550mV @ 3A; 厂家: DIODES(美台); 封装: SMA; 类型: 肖特基二极管; 订货编码: C85098; 型号: B340A-13-F
L1 L2 L9 = 4.7uH/NR2520: 精度 ±20% / 饱和电流 1.37A / 温升电流0.92A / 直流电阻（内阻） 377mΩ / 电感值 4.7uH; 厂家: TDK; 型号: VLS252012ET-4R7M; 类型: Inductor; 订货编码: C98336; 封装: NR2520
L3 L4 L10 L11 = 1kΩ@100MHz: as L5 on sheet AtoD Conversion
L8 L12 = 2.2uH/NR2016: 精度 ±20% / 饱和电流 1.3A / 温升电流1.15A / 直流电阻（内阻） 175mΩ / 电感值 2.2uH; 厂家: Sunlord(顺络); 型号: SPH201610U2R2MT; 类型: Inductor; 订货编码: C96796; 封装: NR2016
P1-P4 = Header 2: Header, 2-Pin; 厂家: /; System: Connector; 型号: /; 封装: /; 类型: /; 订货编码: /
Q1 = DMG6968UDM-7: 漏源电压（Vdss） 20V / 连续漏极电流（Id）（25°C 时） 6.5A / 栅源极阈值电压 900mV @ 250uA / 漏源导通电阻 24mΩ @ 6.5A,4.5V / 最大功率耗散（Ta=25°C） 850mW / 类型 双N沟道(共漏); 厂家: DIODES(美台); 封装: SOT23-6; 类型: MOS(场效应管); 订货编码: C151635; 型号: DMG6968UDM-7
R1 R3 = 470R/0603: 精度 ±1% / 温度系数 ±100ppm/℃ / 功率 0.1W; 厂家: FH(风华); 型号: RS-03K4700FT; 类型: Resistor; 订货编码: C116694; 封装: 0603
R2 = 2K/0603: as R34 on sheet AtoD Conversion
R4 R6 = 10M/0603: 温度系数 ±250ppm/℃ / 精度 ±1% / 阻值 10MΩ / 功率 0.1W; 厂家: FH(风华); 型号: RS-03L1005FT; 类型: Resistor; 订货编码: C322040; 封装: 0603
R5 = 1M/0603: 阻值 1MΩ / 精度 ±1% / 温度系数 ±100ppm/℃ / 功率 0.1W /; 厂家: FH(风华); 型号: RS-03K1004FT; 类型: Resistor; 订货编码: C136593; 封装: 0603
R8 = 1R/0603: ±250ppm/℃ / 精度 ±1% / 阻值 1Ω / 功率 0.1W; 厂家: FH(风华); 型号: RS-03L1R00FT; 类型: Resistor; 订货编码: C174300; 封装: 0603
R10 = 649K/0603: 649kΩ / 精度 ±1% / 温度系数 ±100ppm/℃ / 功率 0.1W; 厂家: FH(风华); 型号: RS-03K6493FT; 类型: Resistor; 订货编码: C321974; 封装: 0603
R12 R18 = 0R/0603: 精度 ±1% / 阻值 0Ω / 功率 0.1W; 厂家: FH(风华); 型号: RS-03000FT; 类型: Resistor; 订货编码: C136582; 封装: 0603
R13 R16 R19 R21 = 100K/0603: as R40 on sheet AtoD Conversion
R15 = 412K/0603: 412kΩ / 精度 ±1% / 温度系数 ±100ppm/℃ / 功率 0.1W; 厂家: FH(风华); 型号: RS-03K4123FT; 类型: Resistor; 订货编码: C321899; 封装: 0603
R17 = 1.4M/0603: ±250ppm/℃ / 精度 ±1% / 阻值 1.4MΩ / 功率 0.1W; 厂家: FH(风华); 型号: RS-03L1404FT; 类型: Resistor; 订货编码: C322055; 封装: 0603
R20 = 150K/0603: 150kΩ / 精度 ±1% / 温度系数 ±100ppm/℃ / 功率 0.1W; 厂家: FH(风华); 型号: RS-03K1503FT; 类型: Resistor; 订货编码: C294649; 封装: 0603
U1 = S-8261AAJMD-G2JT2S: 单节电池保护芯片 / 过充4.325V / 过放2.5V / 过流150mV; 厂家: ABLIC(艾普凌科); 封装: SOT23-6; 类型: 电池保护芯片; 订货编码: C125801; 型号: S-8261AAJMD-G2JT2S
U2 = TPS22917DBVR: 2A负载开关; 厂家: TI(德州仪器); 封装: SOT23-6; 类型: 模拟开关; 订货编码: C2681320; 型号: TPS22917DBVR
U3 = ADP7182AUJZ-5.0-R7: –28 V、 −200 mA、低噪声线性稳压器; 厂家: ADI(亚德诺)/LINEAR; 封装: SOT-23-5; 类型: LDO; 订货编码: C514357; 型号: ADP7182AUJZ-5.0-R7
U4 U7 = TLV61048DBVT: DC-DC芯片 / 最小输入电压 2.5V / 最大输入电压 5.5V / 输出电压（最小值/固定） 0.6V / 输出电压（最大值） 5.5V / 可输出电流 1A / 开关工作频率 1.5MHz; 厂家: TI(德州仪器); 封装: SOT-23-6; 类型: DCDC; 订货编码: C2071944; 型号: TLV61048DBVT
U5 = LP2992AIM5-5.0/NOPB: 16V / 工作电源电流(Max) 4mA / 压降(max) 850mV @ 250mA / 输出电压(可调) - / 静态电流(Iq) - / 最大输出电流 250mA / 输出配置 正 / 纹波抑制(PSRR) 45dB(1kHz) / 工作温度 -40℃~125℃(Tj) / 输出电压(固定) 5V; 厂家: TI(德州仪器); 封装: SOT-23-5; 类型: LDO; 订货编码: C130001; 型号: LP2992AIM5-5.0/NOPB
U6 U17 = TLV62568DBVR: DC-DC芯片 / 最小输入电压 2.5V / 最大输入电压 5.5V / 输出电压（最小值/固定） 0.6V / 输出电压（最大值） 5.5V / 可输出电流 1A / 开关工作频率 1.5MHz; 厂家: TI(德州仪器); 封装: SOT-23-5; 类型: DCDC; 订货编码: C163219; 型号: TLV62568DBVR

## Nets that join several sheets
+1.5V: FPGA (10 pins), Power (C20.2 L12.2 R20.2)
+3V: AtoD Conversion (C46.2 C47.2 U11.3 U11.6), FPGA (25 pins), Power (C16.2 L8.2 R15.2)
+5V: AtoD Conversion (14 pins), Power (C14.1 U5.5)
-5V: AtoD Conversion (C68.1 L5.1 U16.4), Power (C7.1 U3.5)
AGND: AtoD Conversion (36 pins), Power (8 pins)
GND: AtoD Conversion (C46.1 C47.1 U11.1 U11.5), FPGA (42 pins), Power (34 pins)
NetB4_1: AtoD Conversion (B4.1), FPGA (U8.100)
NetQ4_1: AtoD Conversion (Q4.1), FPGA (U8.75)
NetU4_4: FPGA (U8.2), Power (U4.4)

## Assembly variants
高等级阻感容: not fitted BT1 D1 J1 P1 P2 P3 P4 P5 P6 P7 P8 P9; alternate parts B1 -> PB2012-601/1A5, B3 -> PB2012-601/1A5, B2 -> PB2012-601/1A5, B4 -> PB2012-601/1A5, R30 -> RMK1608-K-B-1001-F, R42 -> RMK1608-K-B-1001-F, R35 -> RMK1608-K-B-1001-F, R5 -> RMK1608-K-B-1004-F, C3 -> CT41G-0603-X7R-50V-102-K-N, C10 -> CT41G-0603-X7R-25V-105-K-N, L1 -> NR252012-4R7M, R34 -> RMK1608-K-B-2001-F, R2 -> RMK1608-K-B-2001-F, C20 -> CT41G-0805-X5R-25V-106-M-N, L2 -> NR252012-4R7M, L4 -> PB3216-102/1A0, R24 -> RMK1608-K-B-4701-F, R29 -> RMK1608-K-B-4701-F, R28 -> RMK1608-K-B-4701-F, R27 -> RNK5084-M-E-4701-F, R26 -> RMK1608-K-B-4701-F, R25 -> RMK1608-K-B-4701-F, L7 -> PB3216-102/1A0, L6 -> PB3216-102/1A0, L5 -> PB3216-102/1A0, C12 -> CT41G-0805-X5R-25V-106-M-N, C9 -> CT41G-0603-X7R-50V-104-K-N, L3 -> PB3216-102/1A0, R36 -> RMK1608-K-B-1002-F, R45 -> RMK1608-K-B-1002-F, R43 -> RMK1608-K-B-1002-F, R38 -> RMK1608-K-B-1002-F, R18 -> RMZ1608-B-T-30, R4 -> RMK1608-K-B-1005-F, R6 -> RMK1608-K-B-1005-F, C59 -> CT41G-0603-X7R-50V-103-K-N, C56 -> CT41G-0805-X7R-10V-106-M-N, C52 -> CT41G-0805-X7R-10V-106-M-N, C48 -> CT41G-0805-X7R-10V-106-M-N, C44 -> CT41G-0805-X7R-10V-106-M-N, C42 -> CT41G-0805-X7R-10V-106-M-N, C33 -> CT41G-0805-X7R-10V-106-M-N, C26 -> CT41G-0805-X7R-10V-106-M-N, C18 -> CT41G-1210-X7R-25V-226-M-N, C14 -> CT41G-0805-X5R-25V-106-M-N, C11 -> CT41G-0805-X5R-25V-106-M-N, C6 -> CAK55-H-16V-100uF-K, C5 -> CAK55-H-16V-100uF-K, C1 -> CT41G-0805-X5R-25V-106-M-N, R19 -> RMK1608-K-B-2202-F, R37 -> 30K/0603, R33 -> RMK1608-K-B-300-F, R32 -> RMK1608-K-B-300-F, R39 -> 30K/0603, R22 -> RMK1608-K-B-470-F, R41 -> RMK1608-K-B-1003-F, R40 -> RMK1608-K-B-1003-F, R20 -> RMK1608-K-B-1503-F, R47 -> RMK1608-K-B-1003-F, R46 -> RMK1608-K-B-1003-F, R44 -> RMK1608-K-B-1003-F, R12 -> RMZ1608-B-T-30, R21 -> RMK1608-K-B-1003-F, R16 -> RMK1608-K-B-1003-F, R13 -> RMK1608-K-B-1003-F, C41 -> CT41G-0603-X7R-50V-104-K-N, C69 -> CT41G-0603-X7R-50V-104-K-N, C68 -> CT41G-0603-X7R-50V-104-K-N, C62 -> CT41G-0603-X7R-50V-104-K-N, C61 -> CT41G-0603-X7R-50V-104-K-N, C58 -> CT41G-0603-X7R-50V-104-K-N, C57 -> CT41G-0603-X7R-50V-104-K-N, C55 -> CT41G-0603-X7R-50V-104-K-N, C54 -> CT41G-0603-X7R-50V-104-K-N, C53 -> CT41G-0603-X7R-50V-104-K-N, C51 -> CT41G-0603-X7R-50V-104-K-N, C50 -> CT41G-0603-X7R-50V-104-K-N, C49 -> CT41G-0603-X7R-50V-104-K-N, C47 -> CT41G-0603-X7R-50V-104-K-N, C45 -> CT41G-0603-X7R-50V-104-K-N, C43 -> CT41G-0603-X7R-50V-104-K-N, C40 -> CT41G-0603-X7R-50V-104-K-N, C39 -> CT41G-0603-X7R-50V-104-K-N, C38 -> CT41G-0603-X7R-50V-104-K-N, C37 -> CT41G-0603-X7R-50V-104-K-N, C36 -> CT41G-0603-X7R-50V-104-K-N, C35 -> CT41G-0603-X7R-50V-104-K-N, C34 -> CT41G-0603-X7R-50V-104-K-N, C32 -> CT41G-0603-X7R-50V-104-K-N, C31 -> CT41G-0603-X7R-50V-104-K-N, C30 -> CT41G-0603-X7R-50V-104-K-N, C29 -> CT41G-0603-X7R-50V-104-K-N, C28 -> CT41G-0603-X7R-50V-104-K-N, C27 -> CT41G-0603-X7R-50V-104-K-N, C23 -> CT41G-0603-X7R-50V-104-K-N, C17 -> CT41G-0805-X5R-25V-106-M-N, C15 -> CT41G-0805-X5R-25V-106-M-N, C2 -> CT41G-0603-X7R-50V-104-K-N, C63 -> CC41-0603-CG-50V-101-J-N, C67 -> CC41-0603-CG-50V-101-J-N, C66 -> CC41-0603-CG-50V-101-J-N, C65 -> CC41-0603-CG-50V-101-J-N, C64 -> CC41-0603-CG-50V-101-J-N, C24 -> CC41-0603-CG-50V-101-J-N, C4 -> CC41-0603-CG-50V-101-J-N, R17 -> RMK1608-K-B-1404-F, R15 -> RMK1608-K-B-4123-F, R10 -> RMK1608-K-B-6493-F, R23 -> RMK1608-K-B-3300-F, R1 -> RMK1608-K-B-4700-F, R3 -> RMK1608-K-B-4700-F, R8 -> RMK1608-K-B-1R0-F, Y1 -> ZPB31-20-V3-A4-C1-E, U9 -> EPCS4SI8N, C7 -> CT41G-0805-X5R-25V-106-M-N, C13 -> CT41G-0603-X7R-50V-104-K-N, C8 -> CT41G-0805-X5R-25V-106-M-N, C21 -> CT41G-0603-X7R-50V-103-K-N, C46 -> CT41G-0805-X5R-10V-226-M-N, C60 -> GCL22-12.5X14.4X4.8-100V-474-J, L11 -> PB3216-102/1A0, L10 -> PB3216-102/1A0, L12 -> NR201610-2R2M, L8 -> NR201610-2R2M, L9 -> NR252012-4R7M, C19 -> CT41G-0805-X5R-25V-106-M-N, C16 -> CT41G-0805-X5R-25V-106-M-N
工业级阻感容: not fitted BT1 J1 P1 P2 P3 P4 P5 P6 P7 P8 P9